# Altium project iot_macunum_board.PrjPcb
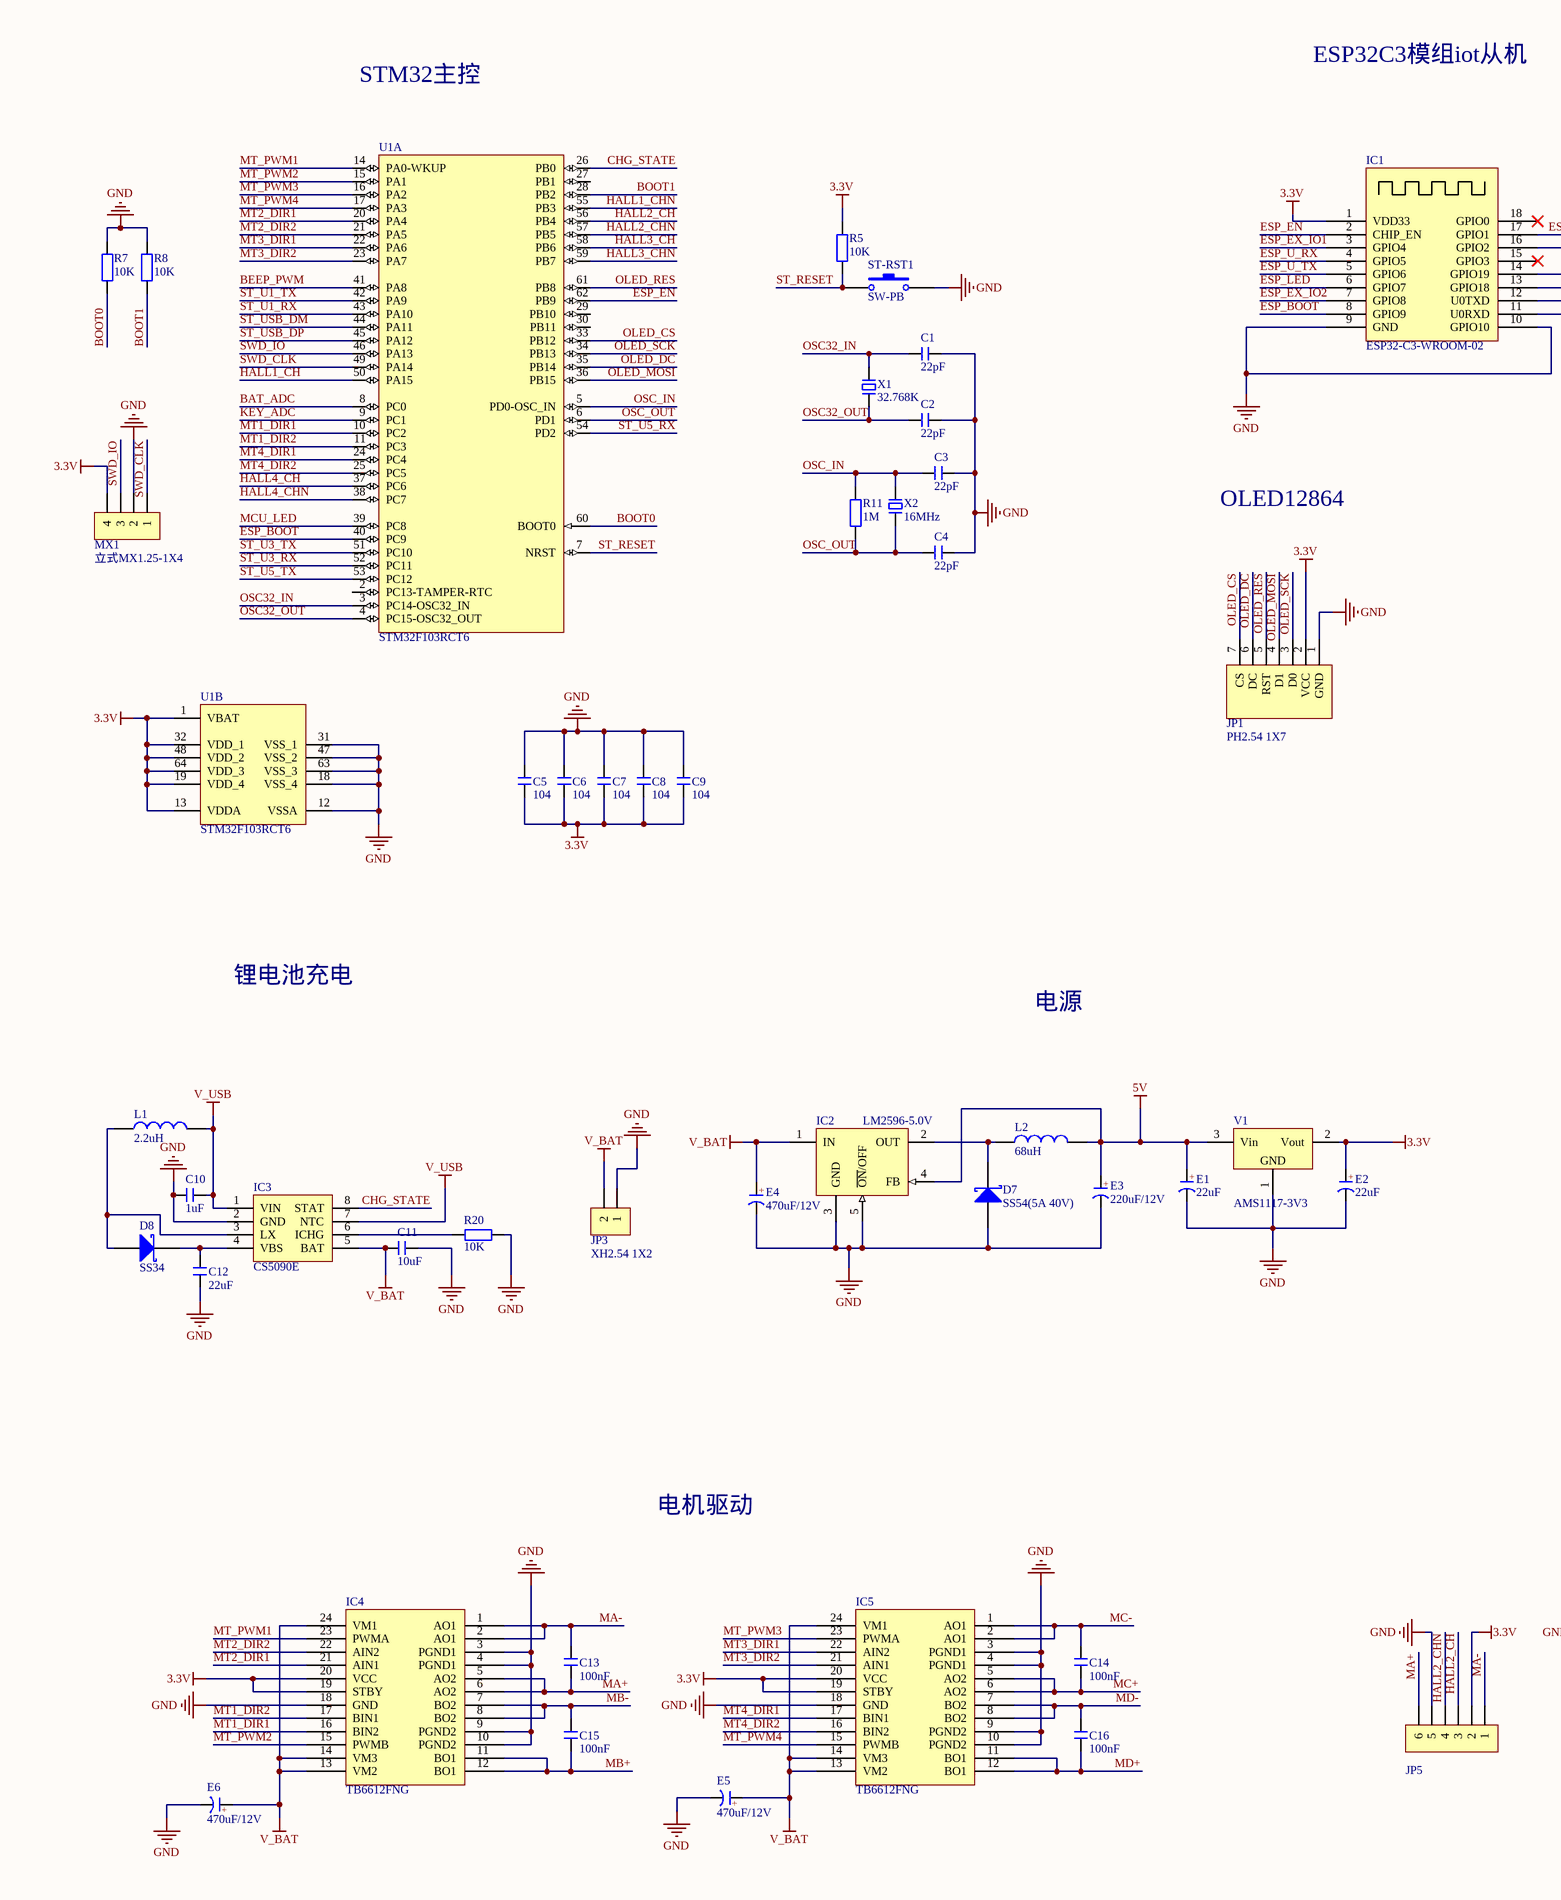
[diagram p0: iot_macuman_board.SchDoc, left]
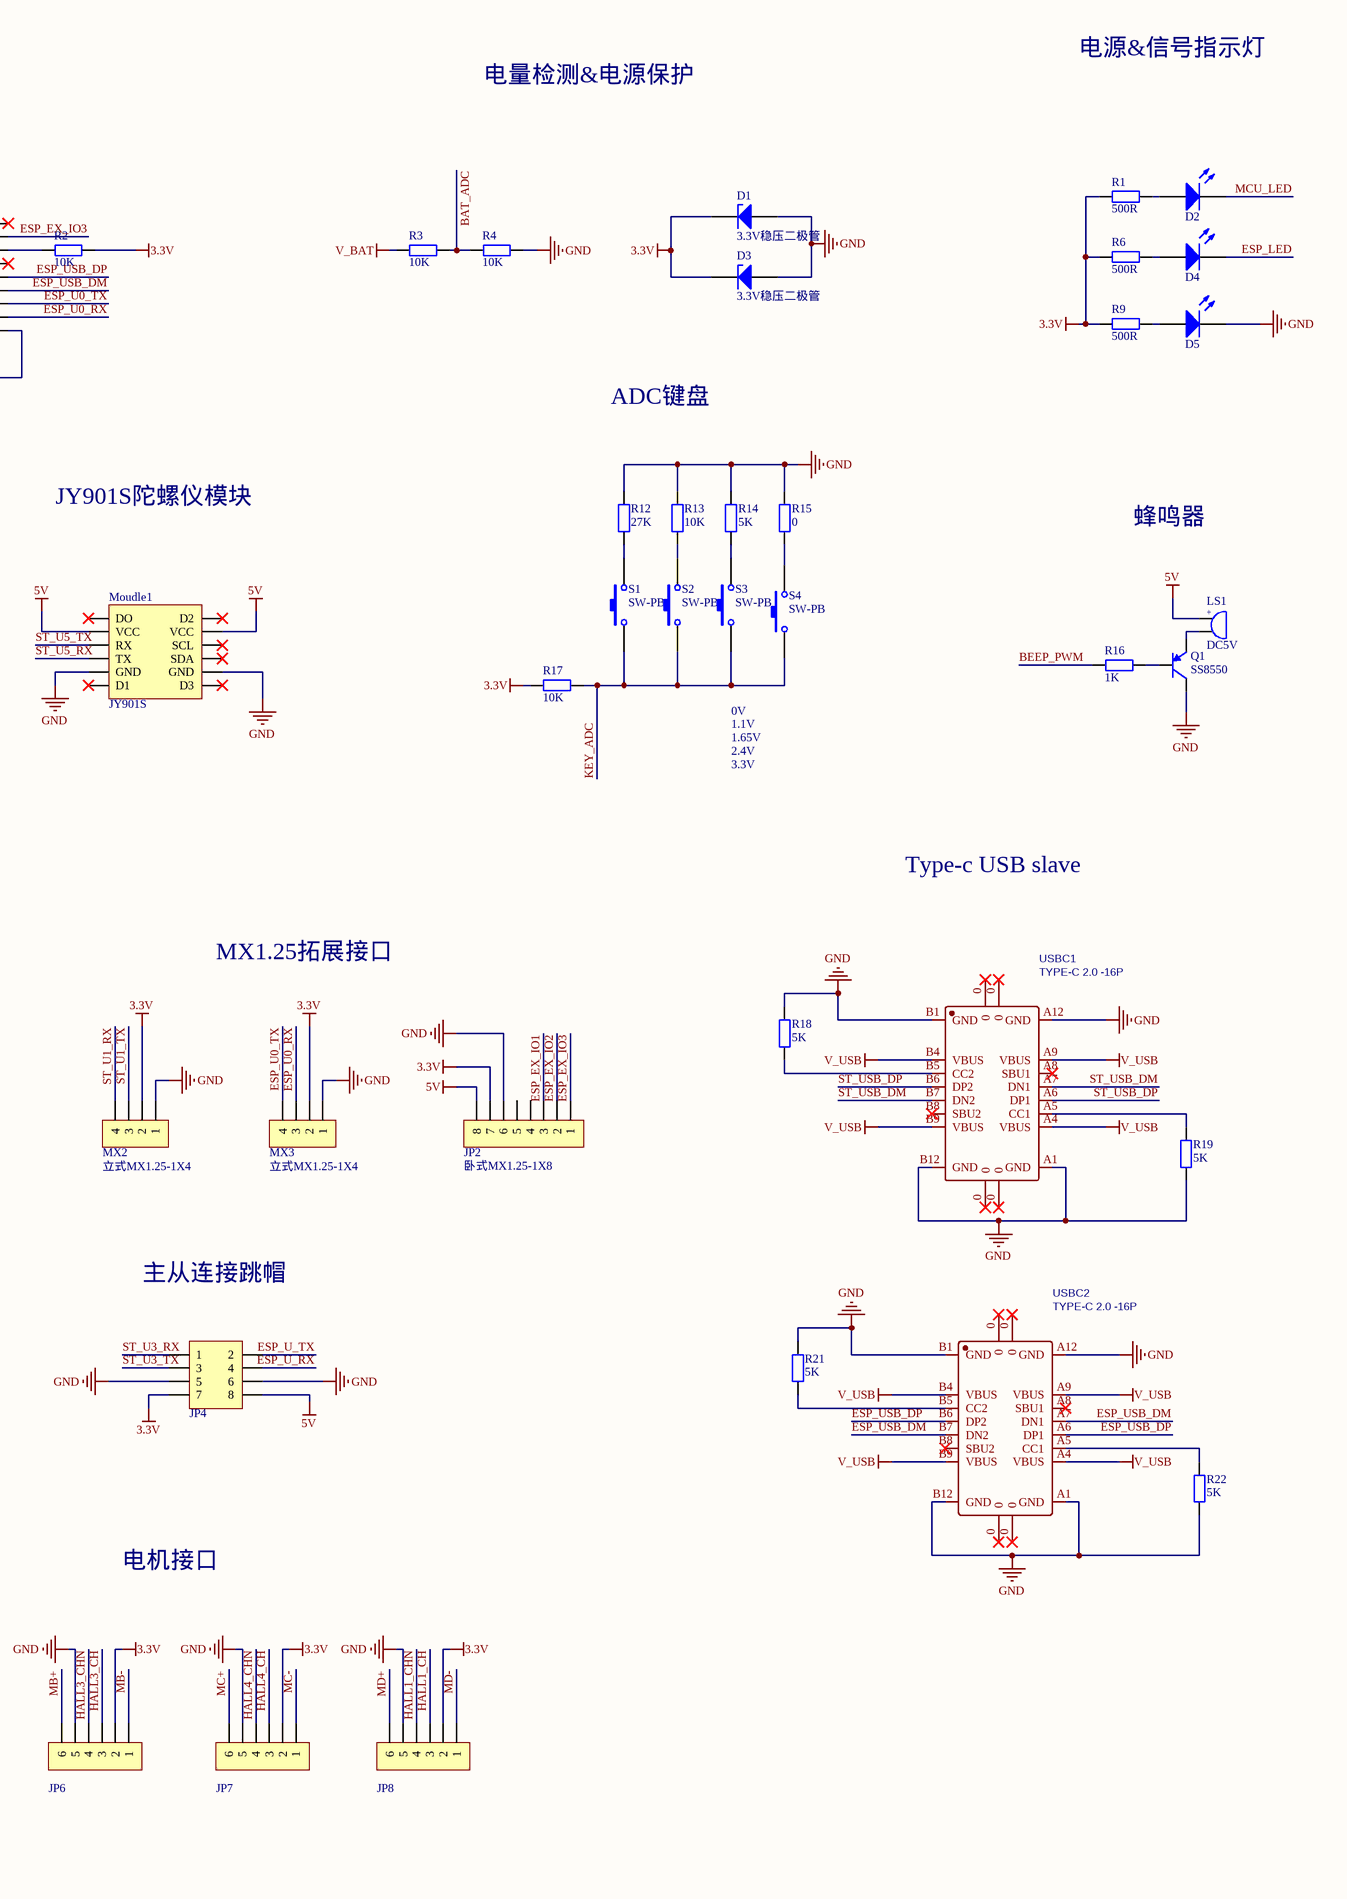
[diagram p1: iot_macuman_board.SchDoc, right]
1 sheet, 82 parts. Net scope: global (net labels, ports and power ports of the same name join across sheets).
Board file: iot_macuman_board.PcbDoc

## Sheet iot_macuman_board.SchDoc
size A2

### Parts
C1  22pF  [C 0402]
C2  22pF  [C 0402]
C3  22pF  [C 0402]
C4  22pF  [C 0402]
C5  104  [C 0402]
C6  104  [C 0402]
C7  104  [C 0402]
C8  104  [C 0402]
C9  104  [C 0402]
C10  1uF  [C 0402]
C11  10uF  [C 0402]
C12  22uF  [C 0603_M]
C13  100nF  [C 0402]
C14  100nF  [C 0402]
C15  100nF  [C 0402]
C16  100nF  [C 0402]
D1  3.3V稳压二极管  [LL34]
D2  LED  [LED 0805G]  (value not drawn)
D3  3.3V稳压二极管  [LL34]
D4  LED  [LED 0805G]  (value not drawn)
D5  LED  [LED 0805G]  (value not drawn)
D7  SS54(5A 40V)  [SMB]
D8  SS34  [SMA]
E1  22uF  [CM C(5*5.4)]
E2  22uF  [CM C(5*5.4)]
E3  220uF/12V  [CM C(5*5.4)]
E4  470uF/12V  [CM E(8*10.2)]
E5  470uF/12V  [CM E(8*10.2)]
E6  470uF/12V  [CM E(8*10.2)]
IC1  ESP32-C3-WROOM-02  [ESP32-C3-WROOM-02]
IC2  LM2596-5.0V  [TO263-5A]
IC3  CS5090E  [SOP8_M]
IC4  TB6612FNG  [SSOP24]
IC5  TB6612FNG  [SSOP24]
JP1  PH2.54 1X7  [HDR2.54-LI-7P]
JP2  卧式MX1.25-1X8  [MX 1.25-WS-8P]
JP3  XH2.54 1X2  [XH2.54-LI-2P]
JP4  PH2.54 4X2  [HDR2.54-LI-2X4P]  (value not drawn)
JP5  电机接口  [XH2.54-WI-6P]  (value not drawn)
JP6  电机接口  [XH2.54-WI-6P]  (value not drawn)
JP7  电机接口  [XH2.54-WI-6P]  (value not drawn)
JP8  电机接口  [XH2.54-WI-6P]  (value not drawn)
L1  2.2uH  [CD32]
L2  68uH  [CD32]
LS1  DC5V  [蜂鸣器(脚距6.5)]
Moudle1  JY901S  [JY901S]
MX1  立式MX1.25-1X4  [MX 1.25-LS-4P]
MX2  立式MX1.25-1X4  [MX 1.25-LS-4P]
MX3  立式MX1.25-1X4  [MX 1.25-LS-4P]
Q1  SS8550  [sot-23]
R1  500R  [R 0402]
R2  10K  [R 0402]
R3  10K  [R 0402]
R4  10K  [R 0402]
R5  10K  [R 0402]
R6  500R  [R 0402]
R7  10K  [R 0402]
R8  10K  [R 0402]
R9  500R  [R 0402]
R11  1M  [R 0402]
R12  27K  [R 0402]
R13  10K  [R 0402]
R14  5K  [R 0402]
R15  0  [R 0402]
R16  1K  [R 0402]
R17  10K  [R 0402]
R18  5K  [R 0402]
R19  5K  [R 0402]
R20  10K  [R 0402]
R21  5K  [R 0402]
R22  5K  [R 0402]
S1  SW-PB  [TSW SMD-3*6*2.5]
S2  SW-PB  [TSW SMD-3*6*2.5]
S3  SW-PB  [TSW SMD-3*6*2.5]
S4  SW-PB  [TSW SMD-3*6*2.5]
ST-RST1  SW-PB  [TSW SMD-3*6*2.5]
U1  STM32F103RCT6  [LQFP64-10*10]  (parts A,B of 2)
USBC1  TYPE-C 2.0 -16P  [USB-C-SMD_TYPE-C-USB-5]
USBC2  TYPE-C 2.0 -16P  [USB-C-SMD_TYPE-C-USB-5]
V1  AMS1117-3V3  [SOT223_L]
X1  32.768K  [OSC 3215-2P]
X2  16MHz  [OSC 5032-2P]

### Nets
3.3V: C5.2 C6.2 C7.2 C8.2 C9.2 D1.2(K) D3.2(K) E2.1(A) IC1.1(VDD33) IC4.19(STBY) IC4.20(VCC) IC5.19(STBY) IC5.20(VCC) JP1.2(VCC) JP2.7 JP4.7 JP5.2 JP6.2 JP7.2 JP8.2 MX1.4 MX2.2 MX3.2 R1.2 R2.2 R5.1 R6.2 R9.2 R17.1 U1.1(VBAT) U1.13(VDDA) U1.19(VDD_4) U1.32(VDD_1) U1.48(VDD_2) U1.64(VDD_3) V1.2(Vout)
5V: E1.1(A) E3.1(A) IC2.4(FB) JP2.8 JP4.8 L2.2 LS1.1 Moudle1.2(VCC) Moudle1.8(VCC) V1.3(Vin)
GND: C1.1 C2.1 C3.1 C4.1 C5.1 C6.1 C7.1 C8.1 C9.1 C10.1 C11.2 C12.2 D1.1(A) D3.1(A) D5.2(K) D7.1(A) E1.2(K) E2.2(K) E3.2(K) E4.2(K) E5.2(K) E6.2(K) IC1.9(GND) IC1.10(GPIO10) IC2.3(GND) IC2.5(~{ON}/OFF) IC3.2(GND) IC4.3(PGND1) IC4.4(PGND1) IC4.9(PGND2) IC4.10(PGND2) IC4.18(GND) IC5.3(PGND1) IC5.4(PGND1) IC5.9(PGND2) IC5.10(PGND2) IC5.18(GND) JP1.1(GND) JP2.6 JP3.1 JP4.5 JP4.6 JP5.5 JP6.5 JP7.5 JP8.5 Moudle1.5(GND) Moudle1.11(GND) MX1.2 MX2.1 MX3.1 Q1.3(C) R4.1 R7.1 R8.1 R12.2 R13.2 R14.2 R15.2 R18.2 R19.1 R20.1 R21.2 R22.1 ST-RST1.2 U1.12(VSSA) U1.18(VSS_4) U1.31(VSS_1) U1.47(VSS_2) U1.63(VSS_3) USBC1.A1(GND) USBC1.A12(GND) USBC1.B1(GND) USBC1.B12(GND) USBC2.A1(GND) USBC2.A12(GND) USBC2.B1(GND) USBC2.B12(GND) V1.1(GND)
V_BAT: C11.1 E4.1(A) E5.1(A) E6.1(A) IC2.1(IN) IC3.5(BAT) IC4.13(VM2) IC4.14(VM3) IC4.24(VM1) IC5.13(VM2) IC5.14(VM3) IC5.24(VM1) JP3.2 R3.2
V_USB: C10.2 IC3.1(VIN) IC3.7(NTC) L1.2 USBC1.A4(VBUS) USBC1.A9(VBUS) USBC1.B4(VBUS) USBC1.B9(VBUS) USBC2.A4(VBUS) USBC2.A9(VBUS) USBC2.B4(VBUS) USBC2.B9(VBUS)
BAT_ADC: R3.1 R4.2 U1.8(PC0)
BEEP_PWM: R16.2 U1.41(PA8)
BOOT0: R7.2 U1.60(BOOT0)
BOOT1: R8.2 U1.28(PB2)
CHG_STATE: IC3.8(STAT) U1.26(PB0)
ESP_BOOT: IC1.8(GPIO9) U1.40(PC9)
ESP_EN: IC1.2(CHIP_EN) U1.62(PB9)
ESP_EX_IO1: IC1.3(GPIO4) JP2.3
ESP_EX_IO2: IC1.7(GPIO8) JP2.2
ESP_EX_IO3: IC1.17(GPIO1) JP2.1
ESP_LED: D4.2(K) IC1.6(GPIO7)
ESP_U0_RX: IC1.11(U0RXD) MX3.3
ESP_U0_TX: IC1.12(U0TXD) MX3.4
ESP_U_RX: IC1.4(GPIO5) JP4.4
ESP_U_TX: IC1.5(GPIO6) JP4.2
ESP_USB_DM: IC1.13(GPIO18) USBC2.A7(DN1) USBC2.B7(DN2)
ESP_USB_DP: IC1.14(GPIO19) USBC2.A6(DP1) USBC2.B6(DP2)
HALL1_CH: JP8.3 U1.50(PA15)
HALL1_CHN: JP8.4 U1.55(PB3)
HALL2_CH: JP5.3 U1.56(PB4)
HALL2_CHN: JP5.4 U1.57(PB5)
HALL3_CH: JP6.3 U1.58(PB6)
HALL3_CHN: JP6.4 U1.59(PB7)
HALL4_CH: JP7.3 U1.37(PC6)
HALL4_CHN: JP7.4 U1.38(PC7)
KEY_ADC: R17.2 S1.1 S2.1 S3.1 S4.1 U1.9(PC1)
MA+: C13.2 IC4.5(AO2) IC4.6(AO2) JP5.6
MA-: C13.1 IC4.1(AO1) IC4.2(AO1) JP5.1
MB+: C15.2 IC4.11(BO1) IC4.12(BO1) JP6.6
MB-: C15.1 IC4.7(BO2) IC4.8(BO2) JP6.1
MC+: C14.2 IC5.5(AO2) IC5.6(AO2) JP7.6
MC-: C14.1 IC5.1(AO1) IC5.2(AO1) JP7.1
MCU_LED: D2.2(K) U1.39(PC8)
MD+: C16.2 IC5.11(BO1) IC5.12(BO1) JP8.6
MD-: C16.1 IC5.7(BO2) IC5.8(BO2) JP8.1
MT1_DIR1: IC4.16(BIN2) U1.10(PC2)
MT1_DIR2: IC4.17(BIN1) U1.11(PC3)
MT2_DIR1: IC4.21(AIN1) U1.20(PA4)
MT2_DIR2: IC4.22(AIN2) U1.21(PA5)
MT3_DIR1: IC5.22(AIN2) U1.22(PA6)
MT3_DIR2: IC5.21(AIN1) U1.23(PA7)
MT4_DIR1: IC5.17(BIN1) U1.24(PC4)
MT4_DIR2: IC5.16(BIN2) U1.25(PC5)
MT_PWM1: IC4.23(PWMA) U1.14(PA0-WKUP)
MT_PWM2: IC4.15(PWMB) U1.15(PA1)
MT_PWM3: IC5.23(PWMA) U1.16(PA2)
MT_PWM4: IC5.15(PWMB) U1.17(PA3)
OLED_CS: JP1.7(CS) U1.33(PB12)
OLED_DC: JP1.6(DC) U1.35(PB14)
OLED_MOSI: JP1.4(D1) U1.36(PB15)
OLED_RES: JP1.5(RST) U1.61(PB8)
OLED_SCK: JP1.3(D0) U1.34(PB13)
OSC32_IN: C1.2 U1.3(PC14-OSC32_IN) X1.1
OSC32_OUT: C2.2 U1.4(PC15-OSC32_OUT) X1.2
OSC_IN: C3.2 R11.2 U1.5(PD0-OSC_IN) X2.1
OSC_OUT: C4.2 R11.1 U1.6(PD1) X2.2
ST_RESET: R5.2 ST-RST1.1 U1.7(NRST)
ST_U1_RX: MX2.4 U1.43(PA10)
ST_U1_TX: MX2.3 U1.42(PA9)
ST_U3_RX: JP4.1 U1.52(PC11)
ST_U3_TX: JP4.3 U1.51(PC10)
ST_U5_RX: Moudle1.4(TX) U1.54(PD2)
ST_U5_TX: Moudle1.3(RX) U1.53(PC12)
ST_USB_DM: U1.44(PA11) USBC1.A7(DN1) USBC1.B7(DN2)
ST_USB_DP: U1.45(PA12) USBC1.A6(DP1) USBC1.B6(DP2)
SWD_CLK: MX1.1 U1.49(PA14)
SWD_IO: MX1.3 U1.46(PA13)
NetC12_1: C12.1 D8.2(K) IC3.4(VBS)
NetD2_1: D2.1(A) R1.1
NetD4_1: D4.1(A) R6.1
NetD5_1: D5.1(A) R9.1
NetD7_2: D7.2(K) IC2.2(OUT) L2.1
NetD8_1: D8.1(A) IC3.3(LX) L1.1
NetIC1_16: IC1.16(GPIO2) R2.1
NetIC3_6: IC3.6(ICHG) R20.2
NetLS1_2: LS1.2 Q1.2(E)
NetQ1_1: Q1.1(B) R16.1
NetR12_1: R12.1 S1.2
NetR13_1: R13.1 S2.2
NetR14_1: R14.1 S3.2
NetR15_1: R15.1 S4.2
NetR18_1: R18.1 USBC1.B5(CC2)
NetR19_2: R19.2 USBC1.A5(CC1)
NetR21_1: R21.1 USBC2.B5(CC2)
NetR22_2: R22.2 USBC2.A5(CC1)

Not connected (* = marked no-connect by the designer): IC1 15(GPIO3)* 18(GPIO0)*; JP2 4 5; Moudle1 1(DO)* 6(D1)* 7(D2)* 9(SCL)* 10(SDA)* 12(D3)*; U1 2(PC13-TAMPER-RTC) 27(PB1) 29(PB10) 30(PB11); USBC1 0* A8(SBU1)* B8(SBU2)*; USBC2 0* A8(SBU1)* B8(SBU2)*

### Notes on the sheet
- ESP32C3模组iot从机
- 电源&信号指示灯
- STM32主控
- 电量检测&电源保护
- ADC键盘
- OLED12864
- JY901S陀螺仪模块
- 蜂鸣器
- 0V
- 1.1V
- 1.65V
- 3.3V
- 2.4V
- Type-c USB slave
- 锂电池充电
- MX1.25拓展接口
- 电源
- 主从连接跳帽
- 电机驱动
- 电机接口
- (in symbol BEEP) +
- (in symbol C-CM) +
- (in symbol CS_SMD) +

### Library data of the parts
C1-C16 = C: 贴片电容; BOM名称: 无极性贴片电容; 淘宝ID: 封装库来自淘宝 ID：黄晶宝石; 联系售后，技术支持: https://shop463601444.taobao.com; 唯一出售店铺网址: https://shop463601444.taobao.com
D1 D3 = 稳压二极管: Zener Diode; 封装库来自淘宝卖家 ID：黄晶宝石: 其他店铺购入均为盗版，不享受售后技术支持服务，请立即申请退款
D2 D4 D5 = LED: 发光二极管; 技术支持，联系售后: https://shop463601444.taobao.com
D7 = 1N5819: 肖特基二极管; 淘宝ID: 封装库来自淘宝 ID：黄晶宝石; 属性: 40V/2A; BOM名称: 肖特基二极管; 欢迎光临: https://shop463601444.taobao.com
D8 = SS34: 肖特基二极管; 属性: 40V/3A; BOM名称: 肖特基二极管; 封装库来自淘宝 ID：黄晶宝石: https://shop463601444.taobao.com
E1-E3 = CS_SMD: 贴片固态电容; 版权归属: 封装库来自淘宝 ID：黄晶宝石; BOM名称: 贴片固态电容; 联系售后: https://shop463601444.taobao.com
E4-E6 = C-CM: 贴片电解电容; 版权归属: 封装库来自淘宝 ID：黄晶宝石; BOM名称: 贴片电解电容; 联系售后: https://shop463601444.taobao.com
IC1 = ESP32-C3-WROOM-02: ESP32C3模组
IC2 = LM2596-5.0: DC降压芯片; BOM名称: DC稳压芯片; 版权归属: 封装库来自淘宝 ID：黄晶宝石; 学习资源: https://shop463601444.taobao.com
IC3 = CS5090E: 8.4V锂电池充电芯片
IC4 IC5 = TB6612FNG: 电机驱动IC
JP1 = OLED 1.3-12864_7pin: 12864 点阵屏; 版权归属: 封装库来自淘宝 ID：黄晶宝石; BOM名称: 12864 点阵屏; 技术支持，联系售后: https://shop463601444.taobao.com
JP2 = Header 8: 8P接插件; BOM名称: 4P接插件; 联系售后: 封装库来自淘宝 ID：黄晶宝石; 学习资源: https://shop463601444.taobao.com
JP3 = Header 2
JP4 = Header 4X2: 4*2P接插件; 版权归属: 封装库来自淘宝 ID：黄晶宝石; BOM名称: 4*2P接插件; 学习资源: https://shop463601444.taobao.com
JP5-JP8 = Header 6: 6P接插件; 版权归属: 封装库来自淘宝 ID：黄晶宝石; BOM名称: 6P接插件; 学习资源: https://shop463601444.taobao.com
L1 L2 = L: 小功率贴片电感; 淘宝ID: 封装库来自淘宝 ID：黄晶宝石; 封装库来自淘宝卖家 ID：黄晶宝石: 其他店铺购入均为盗版，不享受售后技术支持服务，请立即申请退款; BOM名称: 小功率贴片电感; 联系售后: https://shop463601444.taobao.com
LS1 = BEEP: 蜂鸣器; 版权归属: 封装库来自淘宝 ID：黄晶宝石; BOM名称: 蜂鸣器; 技术支持，联系售后: https://shop463601444.taobao.com
MX1-MX3 = Header 4: 4P接插件; 联系售后: 封装库来自淘宝 ID：黄晶宝石; BOM名称: 4P接插件; 学习资源: https://shop463601444.taobao.com
Q1 = 8550-SMD: 高频放大-PNP型; 版权归属: 封装库来自淘宝 ID：黄晶宝石; 属性: 40V 1.5A 1W 100MHZ; BOM名称: 高频放大-PNP型; 学习资源: www.ooocke.com
R1-R9 R11-R22 = R: 贴片电阻; 版权归属: 来自淘宝 ID：黄晶宝石; 封装库来自淘宝卖家 ID：黄晶宝石: 其他店铺购入均为盗版，不享受售后技术支持服务，请立即申请退款; BOM名称: 贴片电阻; 联系售后: https://shop463601444.taobao.com
S1-S4 ST-RST1 = SW-PB: 微动开关; Published: 24-Mar-1999; LatestRevisionDate: 17-Jul-2002; LatestRevisionNote: Re-released for DXP Platform.; PackageReference: SPST-2; Publisher: Altium Limited
U1 = STM32F103RCT6: STM32 ARM-based 32-bit MCU Performance Line with 256 kB Flash, 48 kB Internal RAM, -40 to +85癈 Temperature, 64-Pin LQFP, Tray; DatasheetVersion: rev8.0, Apr-2011; PackageVersion: rev13, Apr-2011; PackageReference: LQFP64; PackageDescription: 64-Pin Low-Profile Quad Flat Pack, 10 x 10 mm Body, 0.5 mm Pitch (LQFP64); ComponentLink1Description: Manufacturer URL; ComponentLink1URL: http://www.st.com/; ComponentLink2Description: STM32F103 Datasheet; ComponentLink2URL: http://www.st.com/internet/com/TECHNICAL_RESOURCES/TECHNICAL_LITERATURE/DATASHEET/CD00191185.pdf; ComponentLink3Description: STM32 Family Web Page; ComponentLink3URL: www.st.com/stm32
USBC1 USBC2 = USB2.0 Type-C 16Pin母座: USB2.0 Type-C 母座 16Pin; BOM_Manufacturer: LCSC; BOM_Supplier: LCSC; BOM_Manufacturer Part: -; spicePre: U; spiceSymbolName: TYPE-C 3.1 -16P_C168689
V1 = AMS1117: 三端稳压芯片; BOM名称: 稳压芯片; 淘宝ID: 封装库来自淘宝 ID：黄晶宝石; 欢迎光临淘宝店铺: https://shop463601444.taobao.com
X1 X2 = XTAL-2P: 2脚无源脚晶振; 版权归属: 封装库来自淘宝卖家 ID：黄晶宝石; BOM名称: 2脚无源脚晶振; 学习资源: https://shop463601444.taobao.com